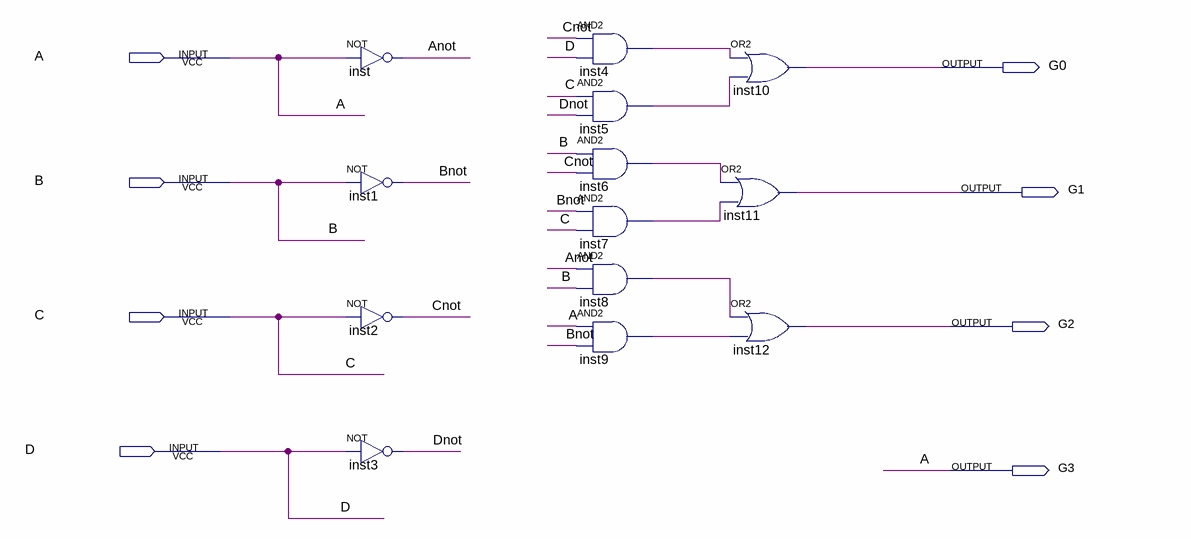
[diagram p0: schematic sheet]
// Quartus schematic Lab3.bdf as structural Verilog: 13 symbols, 8 pins
module Lab3 (
  input  A,
  input  B,
  input  C,
  input  D,
  output G0,
  output G1,
  output G2,
  output G3
);

  wire Anot, Bnot, Cnot, Dnot, inst4_out, inst5_out, inst6_out, inst7_out, inst8_out, inst9_out;

  not inst (Anot, A);
  not inst1 (Bnot, B);
  not inst2 (Cnot, C);
  not inst3 (Dnot, D);
  and inst4 (inst4_out, Cnot, D);
  and inst5 (inst5_out, C, Dnot);
  and inst6 (inst6_out, B, Cnot);
  and inst7 (inst7_out, Bnot, C);
  and inst8 (inst8_out, Anot, B);
  and inst9 (inst9_out, A, Bnot);
  or inst10 (G0, inst4_out, inst5_out);
  or inst11 (G1, inst6_out, inst7_out);
  or inst12 (G2, inst8_out, inst9_out);

  assign G3 = A;
endmodule
